# EAGLE design ps_3PS_detect (EAGLE 7.2.0)
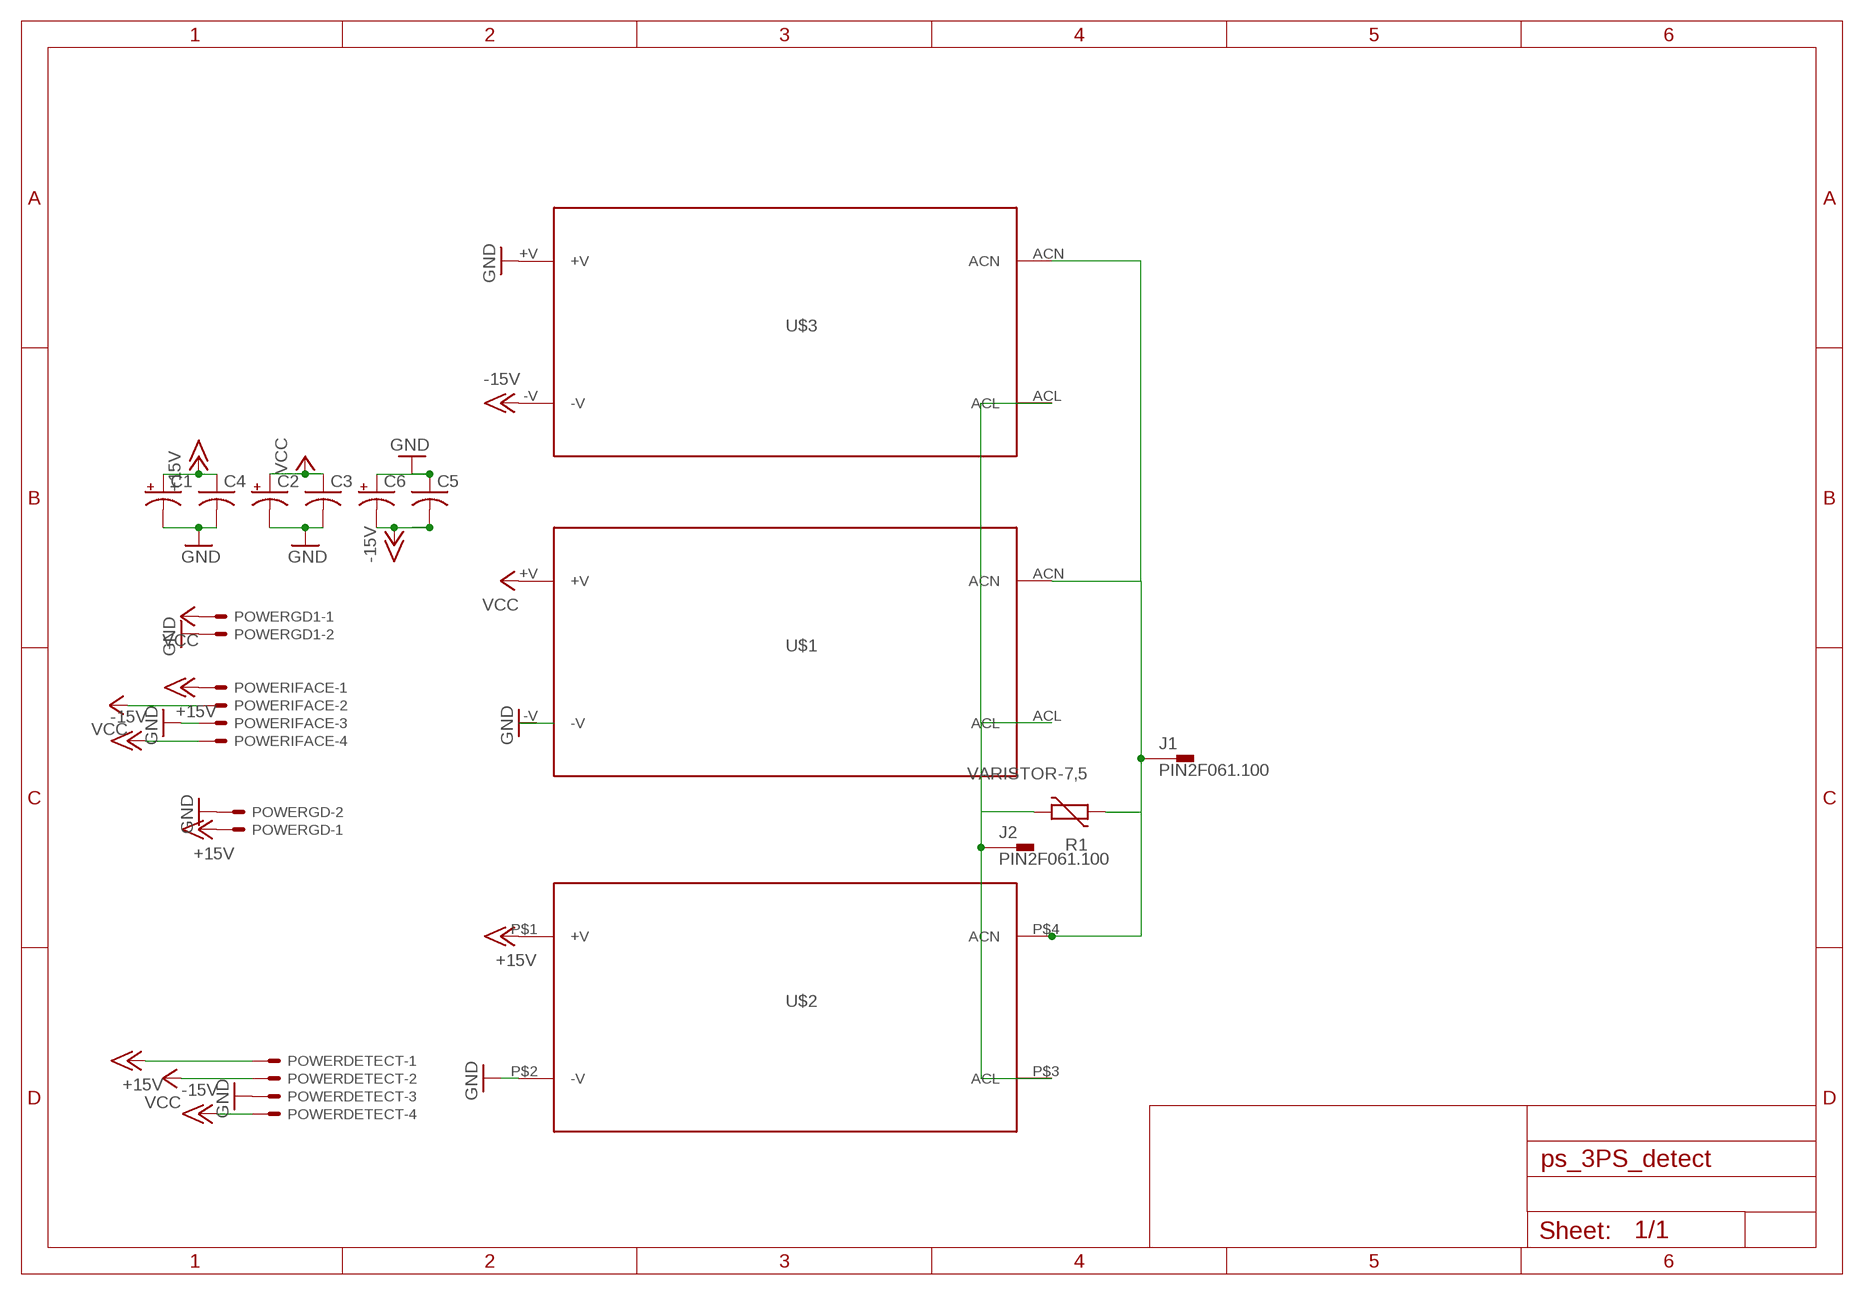
[diagram p0: schematic, sheet 1]

## Parts
C1  CPOL-USE5-13  [E5-13]
C2  CPOL-USE5-13  [E5-13]
C3  C-US050-050X075  [C050-050X075]
C4  C-US050-050X075  [C050-050X075]
C5  C-US050-050X075  [C050-050X075]
C6  CPOL-USE5-13  [E5-13]
J1  PIN2F061.100  [F061.100]
J2  PIN2F061.100  [F061.100]
POWERDETECT  KK-156-4  [KK-156-4]
POWERGD  KK-156-2  [KK-156-2]
POWERGD1  KK-156-2  [KK-156-2]
POWERIFACE  KK-156-4  [KK-156-4]
R1  VARISTOR-7,5  [R-7,5]
U$1  IRM-05-05  [IRM-05-05]
U$2  IRM-60-12  [IRM-60-12]
U$3  IRM-30-15  [IRM-30-15]

## Nets
+15V: C1.+ C4.1 POWERDETECT.1 POWERGD.1 POWERIFACE.1 U$2.P$1(+V)
-15V: C5.2 C6.- POWERDETECT.4 POWERIFACE.4 U$3.-V
GND: C1.- C2.- C3.2 C4.2 C5.1 C6.+ POWERDETECT.3 POWERGD1.2 POWERGD.2 POWERIFACE.3 U$1.-V U$2.P$2(-V) U$3.+V
N$1: J1.A1 J1.A2 R1.2 U$1.ACN U$2.P$4(ACN) U$3.ACN
N$2: J2.A1 J2.A2 R1.1 U$1.ACL U$2.P$3(ACL) U$3.ACL
VCC: C2.+ C3.1 POWERDETECT.2 POWERGD1.1 POWERIFACE.2 U$1.+V

## Library data of the parts
C1 C2 C6 = rcl:CPOL-US: POLARIZED CAPACITOR, American symbol
C3-C5 = rcl:C-US: CAPACITOR, American symbol
J1 J2 = con-faston:PIN2: Flachstecker Typ Tyco/Electronics/AMP TAB, FASTON Printed Circuit Board Tabs Source: http://www.buerklin.com, http://catalog.tycoelectronics.com; OC_FARNELL: unknown; OC_NEWARK: unknown
POWERDETECT POWERIFACE = con-molex:KK-156-4: KK 156 HEADER Source: http://www.molex.com/pdm_docs/sd/026604100_sd.pdf; OC_FARNELL: unknown; OC_NEWARK: unknown
POWERGD POWERGD1 = con-molex:KK-156-2: KK 156 HEADER Source: http://www.molex.com/pdm_docs/sd/026604100_sd.pdf; OC_FARNELL: unknown; OC_NEWARK: unknown
R1 = varistor:VARISTOR: VARISTOR
U$1 = meanwell:IRM-05-05
U$2 = meanwell:IRM-60-12
U$3 = meanwell:IRM-30-15

## Board
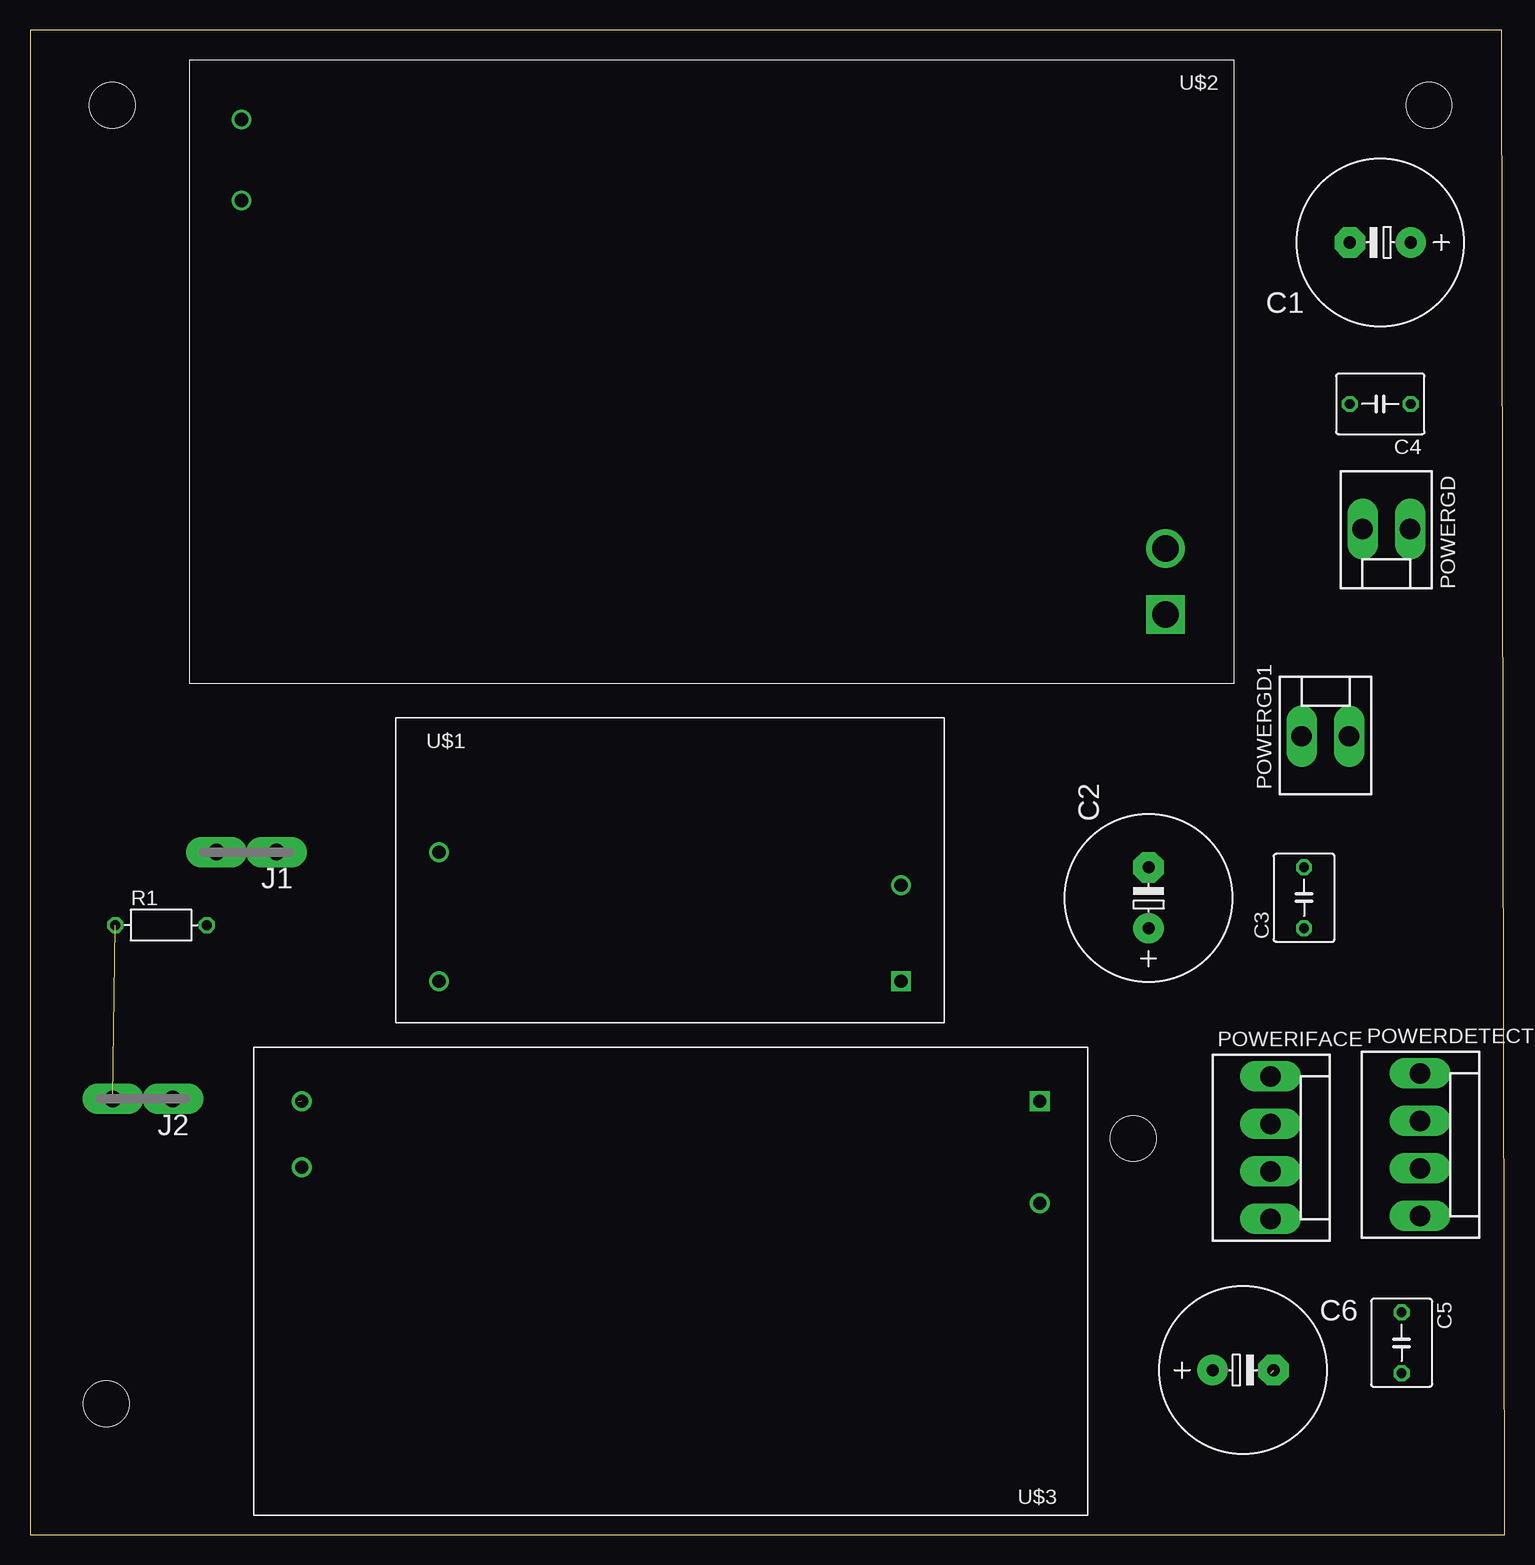
[diagram p1: board, top side]
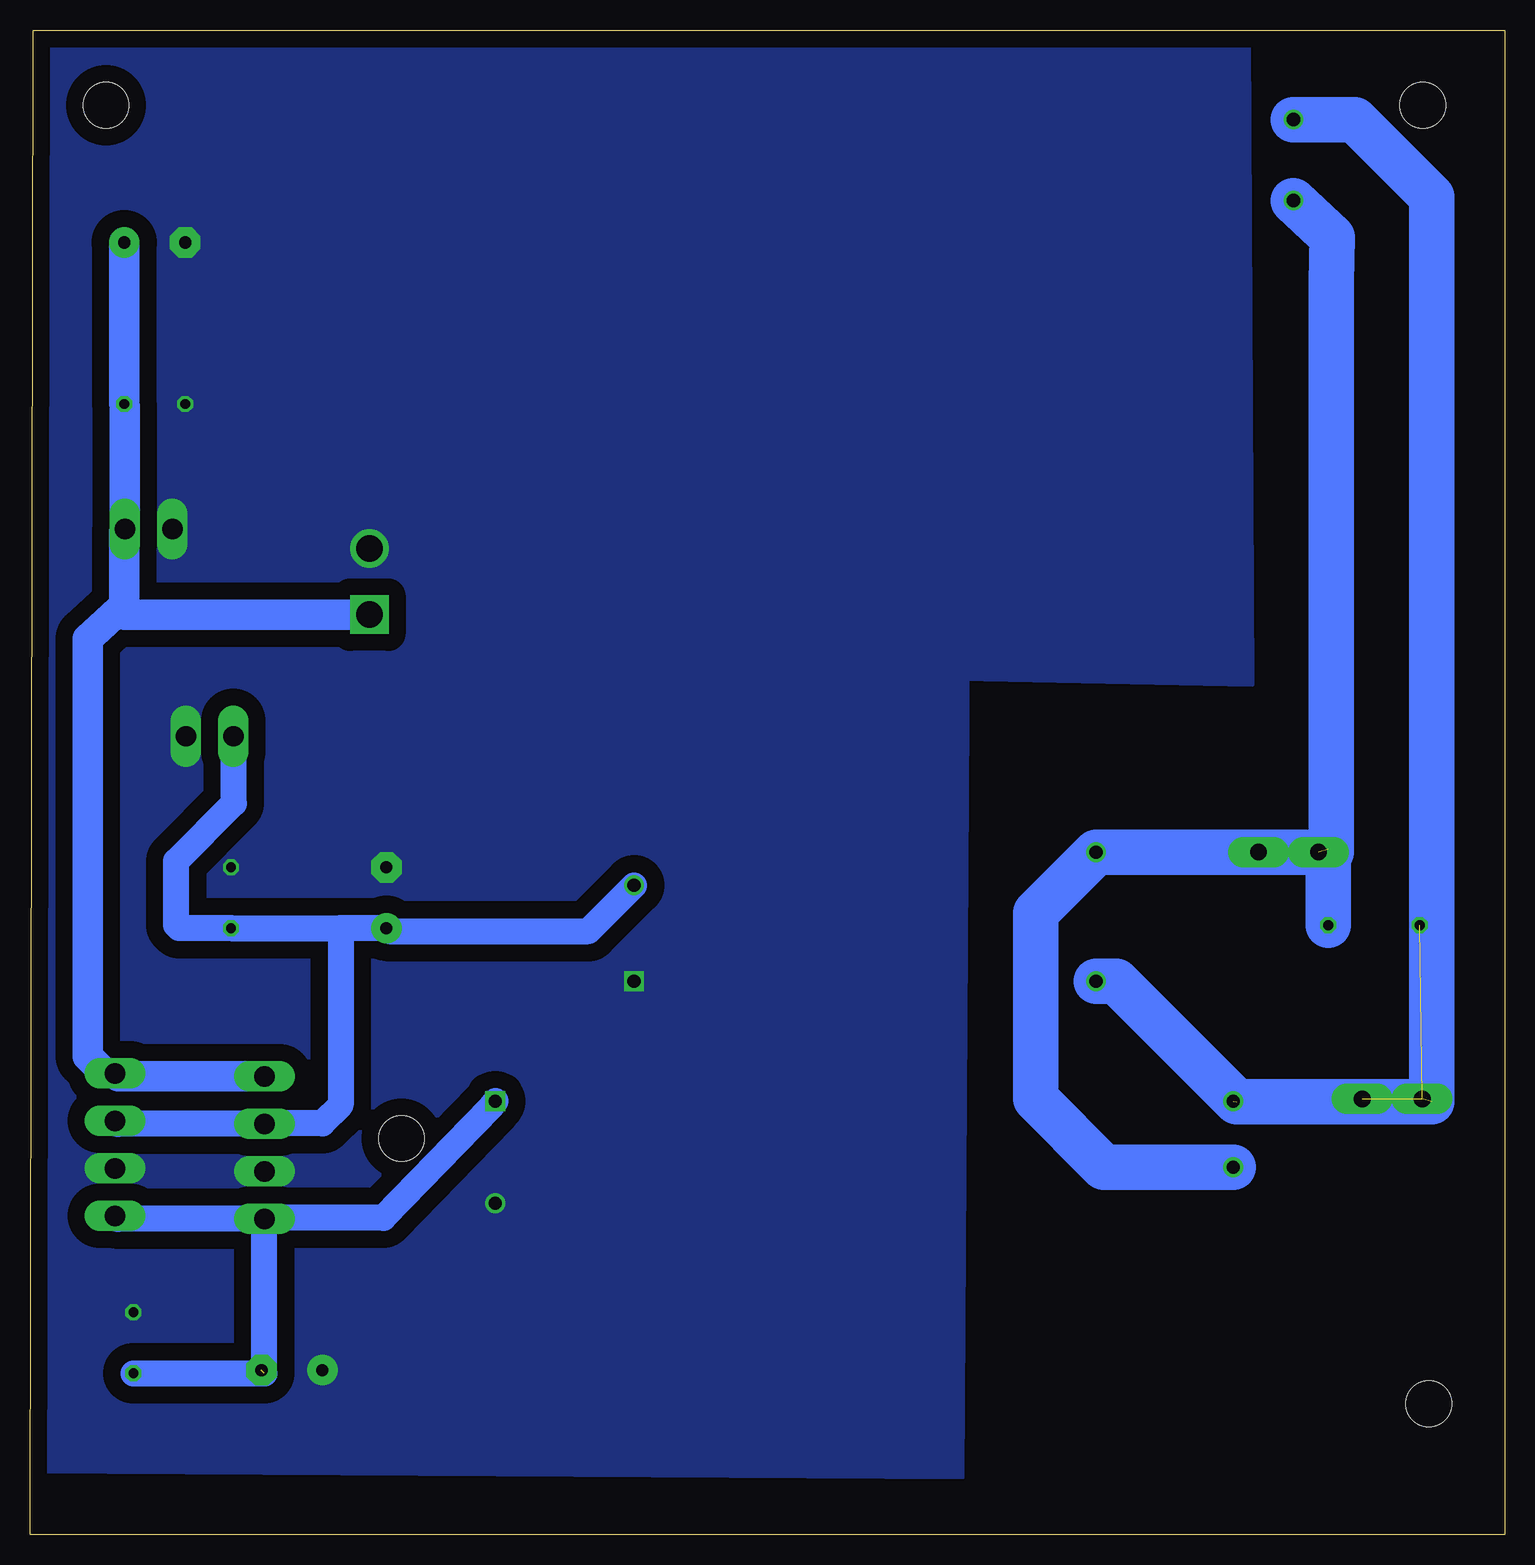
[diagram p2: board, bottom side, seen from below]

Size 122.92 x 125.4 mm. Coordinates in mm from the lower left corner, seen from the top.
Outline: 0,0 122.92,0 122.66,125.4 0,125.4 0,0
Copper layers (1*16): Top 0.035mm / dielectric 1.5mm / Bottom 0.035mm
Design rules "default": minimum track width 10mil, minimum drill 24mil, track to track 8mil, track to pad 8mil, pad to pad 8mil, via to via 8mil, smd to smd 8mil, copper to edge 40mil, drill to drill 8mil, minimum pad ring 10mil, minimum via ring 8mil, stop-mask expansion 4mil, vias tented up to drill 0mil, thermal gap 10mil
Holes 3.8 mm at 116.59,119.13 91.95,33.02 6.86,119.13 6.35,10.92

### Footprints (pad centres in the part's own frame; a part is rotated, then mirrored left to right if it is on the bottom)
E5-13 = drill 1.016 pad 2.54: + -2.54,0 | drill 1.016 pad 2.54 octagon: - 2.54,0
C050-050X075 = drill 0.813 octagon: 1 -2.54,0; 2 2.54,0
F061.100 = drill 1.4 pad 2.54 long: A1 -2.5,0; A2 2.5,0
KK-156-4 = drill 1.7 pad 2.184 long: 1 -5.94,0; 2 -1.98,0; 3 1.98,0; 4 5.94,0
KK-156-2 = drill 1.7 pad 2.184 long: 1 -1.98,0; 2 1.98,0
R-7,5 = drill 0.813 octagon: 1 -3.81,0; 2 3.81,0
IRM-05-05 = drill 1.1: +V 42.1,11.45; ACL 3.6,3.45; ACN 3.6,14.2 | drill 1.1 square: -V 42.1,3.45
IRM-60-12 = drill 2.2 square: P$1 5.7,46.25 | drill 2.2: P$2 5.7,40.75 | drill 1.1: P$3 82.7,5; P$4 82.7,11.75
IRM-30-15 = drill 1.1: +V 4,13; ACL 65.5,4.5; ACN 65.5,10 | drill 1.1 square: -V 4,4.5

### Placement (x,y rotation side)
C1  112.52,107.7 180 top
C2  93.22,53.09 90 top
C3  106.17,53.09 90 top
C4  112.52,94.23 180 top
C5  114.3,16 270 top
C6  101.09,13.72 0 top
J1  18.03,56.9 180 top
J2  9.4,36.32 180 top
POWERDETECT  115.82,32.51 270 top
POWERGD  113.03,83.82 180 top
POWERGD1  107.95,66.55 0 top
POWERIFACE  103.38,32.26 270 top
R1  10.92,50.8 0 top
U$1  30.48,42.67 0 top
U$2  100.33,122.94 180 top
U$3  88.14,40.64 180 top

### Tracks (layer width: path | path; a pad name or v marks a point on that pad's centre or on a via)
+15V
  Bottom 2.54: U$2.P$1 115.04,76.69 115.06,77.47 | 115.06,77.47 115.06,83.51 POWERGD.1 115.01,94.03 C4.1 C1.+ | POWERIFACE.1 115.57,38.2 POWERDETECT.1 116.68,38.45 118.11,39.88 118.11,74.68 115.06,77.47
-15V  (1 unrouted)
  Bottom 2.184: C5.2 103.38,13.46 POWERIFACE.4 104.14,26.32 | 104.14,26.32 115.57,26.32 POWERDETECT.4 | U$3.-V 84.51,35.63 93.47,26.42 104.04,26.42 104.14,26.32
GND
  pour Bottom (isolate 1.422, no thermals): 44.45,124.97 122.68,125.22 122.94,5.33 45.21,4.83
N$1  (1 unrouted)
  Bottom 3.81: U$2.P$4 14.41,108.14 14.48,104.39 14.48,57.4 | 14.48,57.4 14.48,56.9 | 14.48,56.9 18.57,56.87 | 14.48,56.9 J1.A1 23.88,56.9 29.19,56.87 U$1.ACN 39.12,51.84 39.12,36.32 33.43,30.64 U$3.ACN | R1.2 14.73,57.15 14.48,57.4
N$2  (4 unrouted)
  Bottom 3.81: U$1.ACL 32.41,46.12 22.35,36.07 6.1,36.07 6.1,111.51 12.53,117.94 U$2.P$3
N$3
  pour Bottom (isolate 1.422, no thermals): 21.34,124.97 45.21,125.22 45.47,71.37 21.08,70.87
VCC
  Bottom 2.184: 97.03,50.55 C2.+ 92.98,50.31 76.39,50.31 U$1.+V | POWERGD1.1 105.92,66.5 105.92,60.96 110.74,56.13 110.74,50.8 110.49,50.55 C3.1 97.03,50.55 | 97.03,50.55 97.03,35.81 98.55,34.29 103.33,34.29 POWERIFACE.2 115.57,34.24 POWERDETECT.2